# Altium schematic sheet [25] - LCD,TSC.SchDoc
size A2; DocumentNumber: 25; SheetNumber: 25; SheetTotal: 32
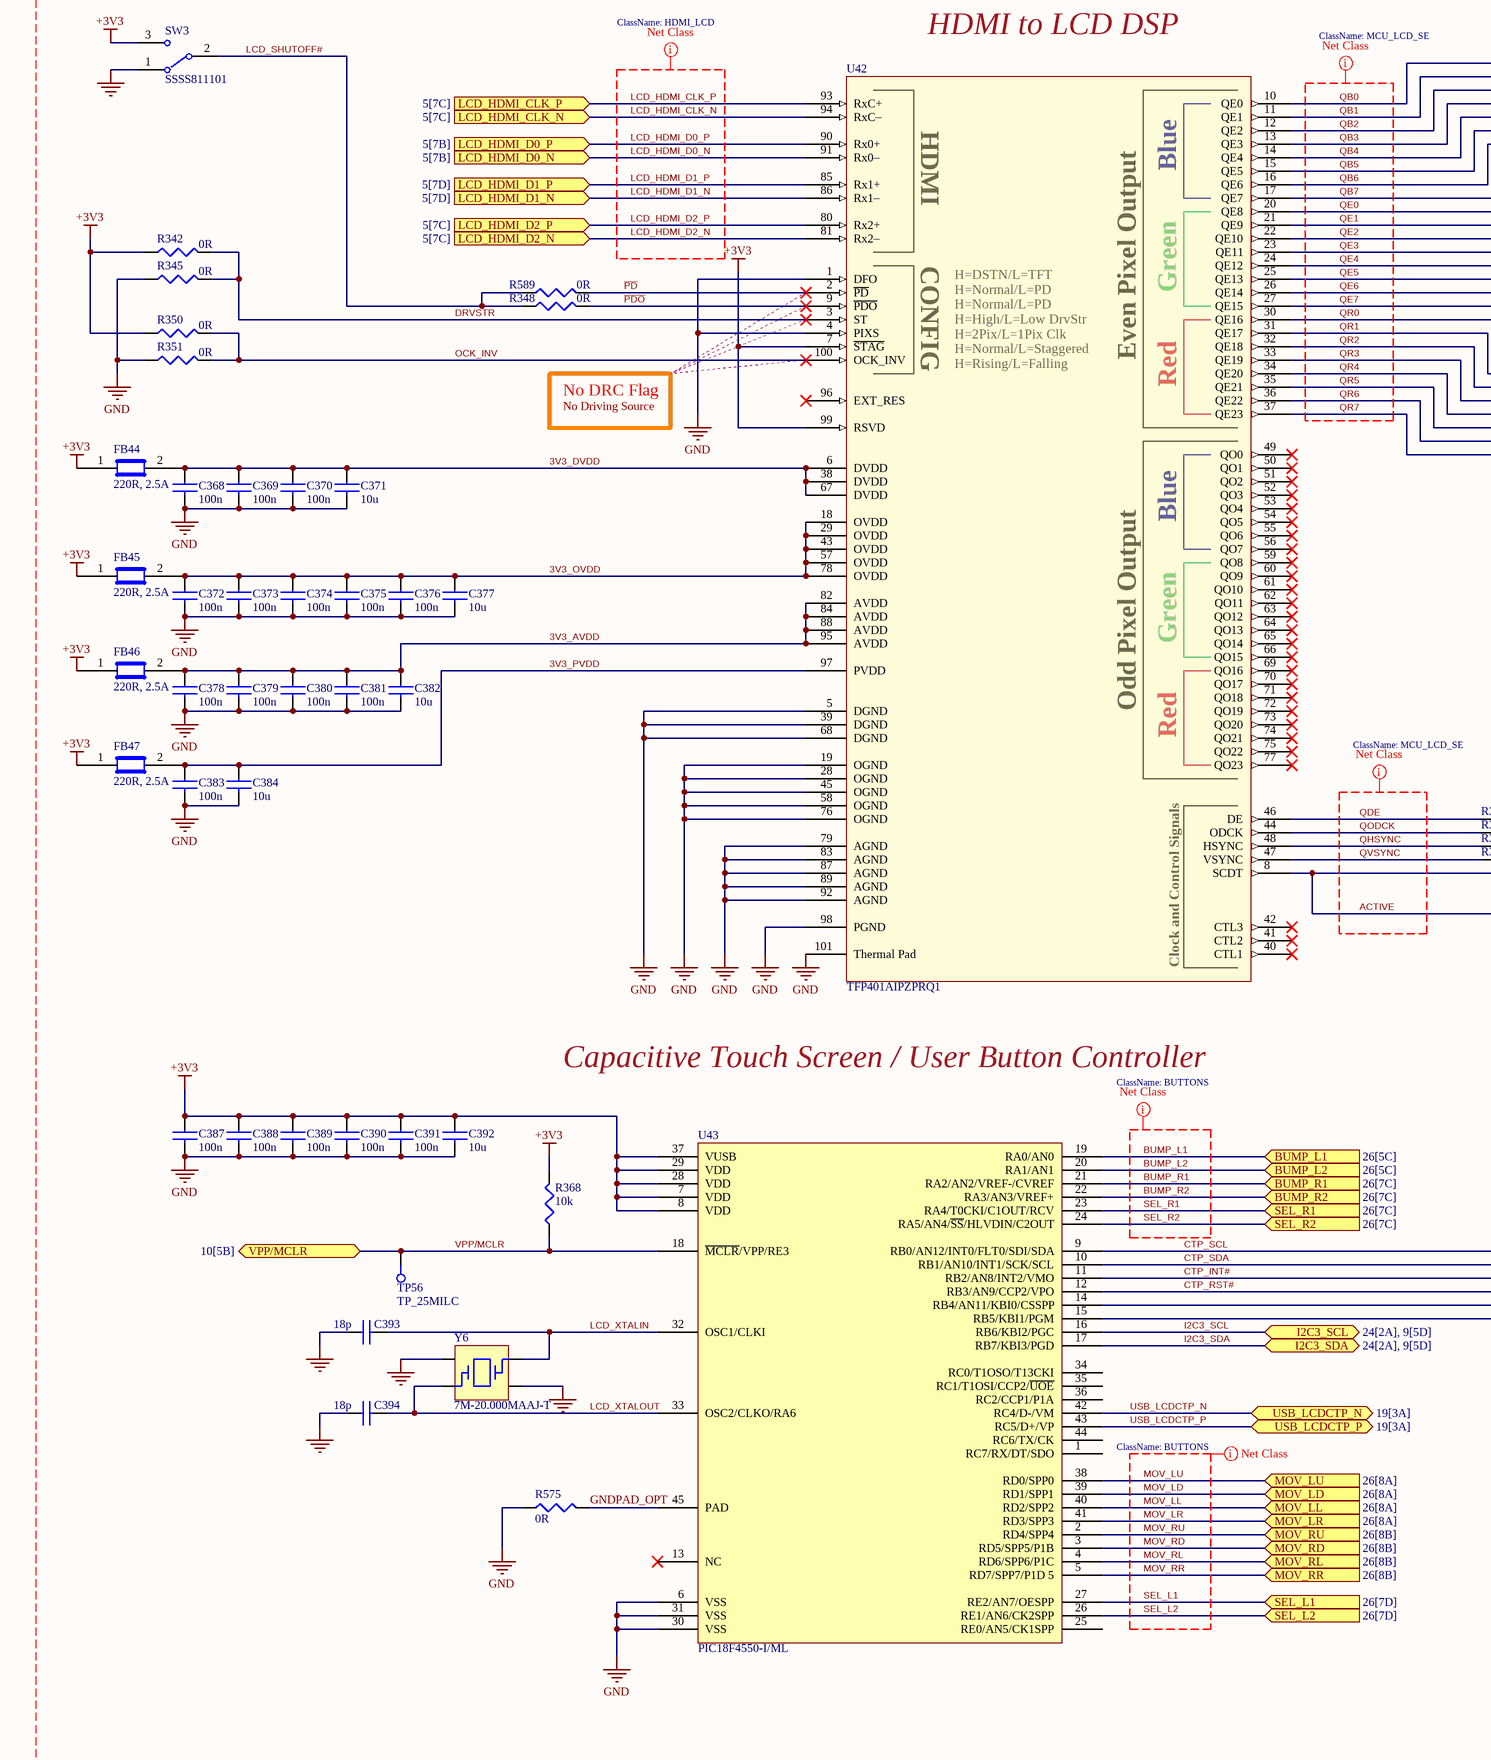
[diagram p0: [25] - LCD,TSC.SchDoc, bottom left]
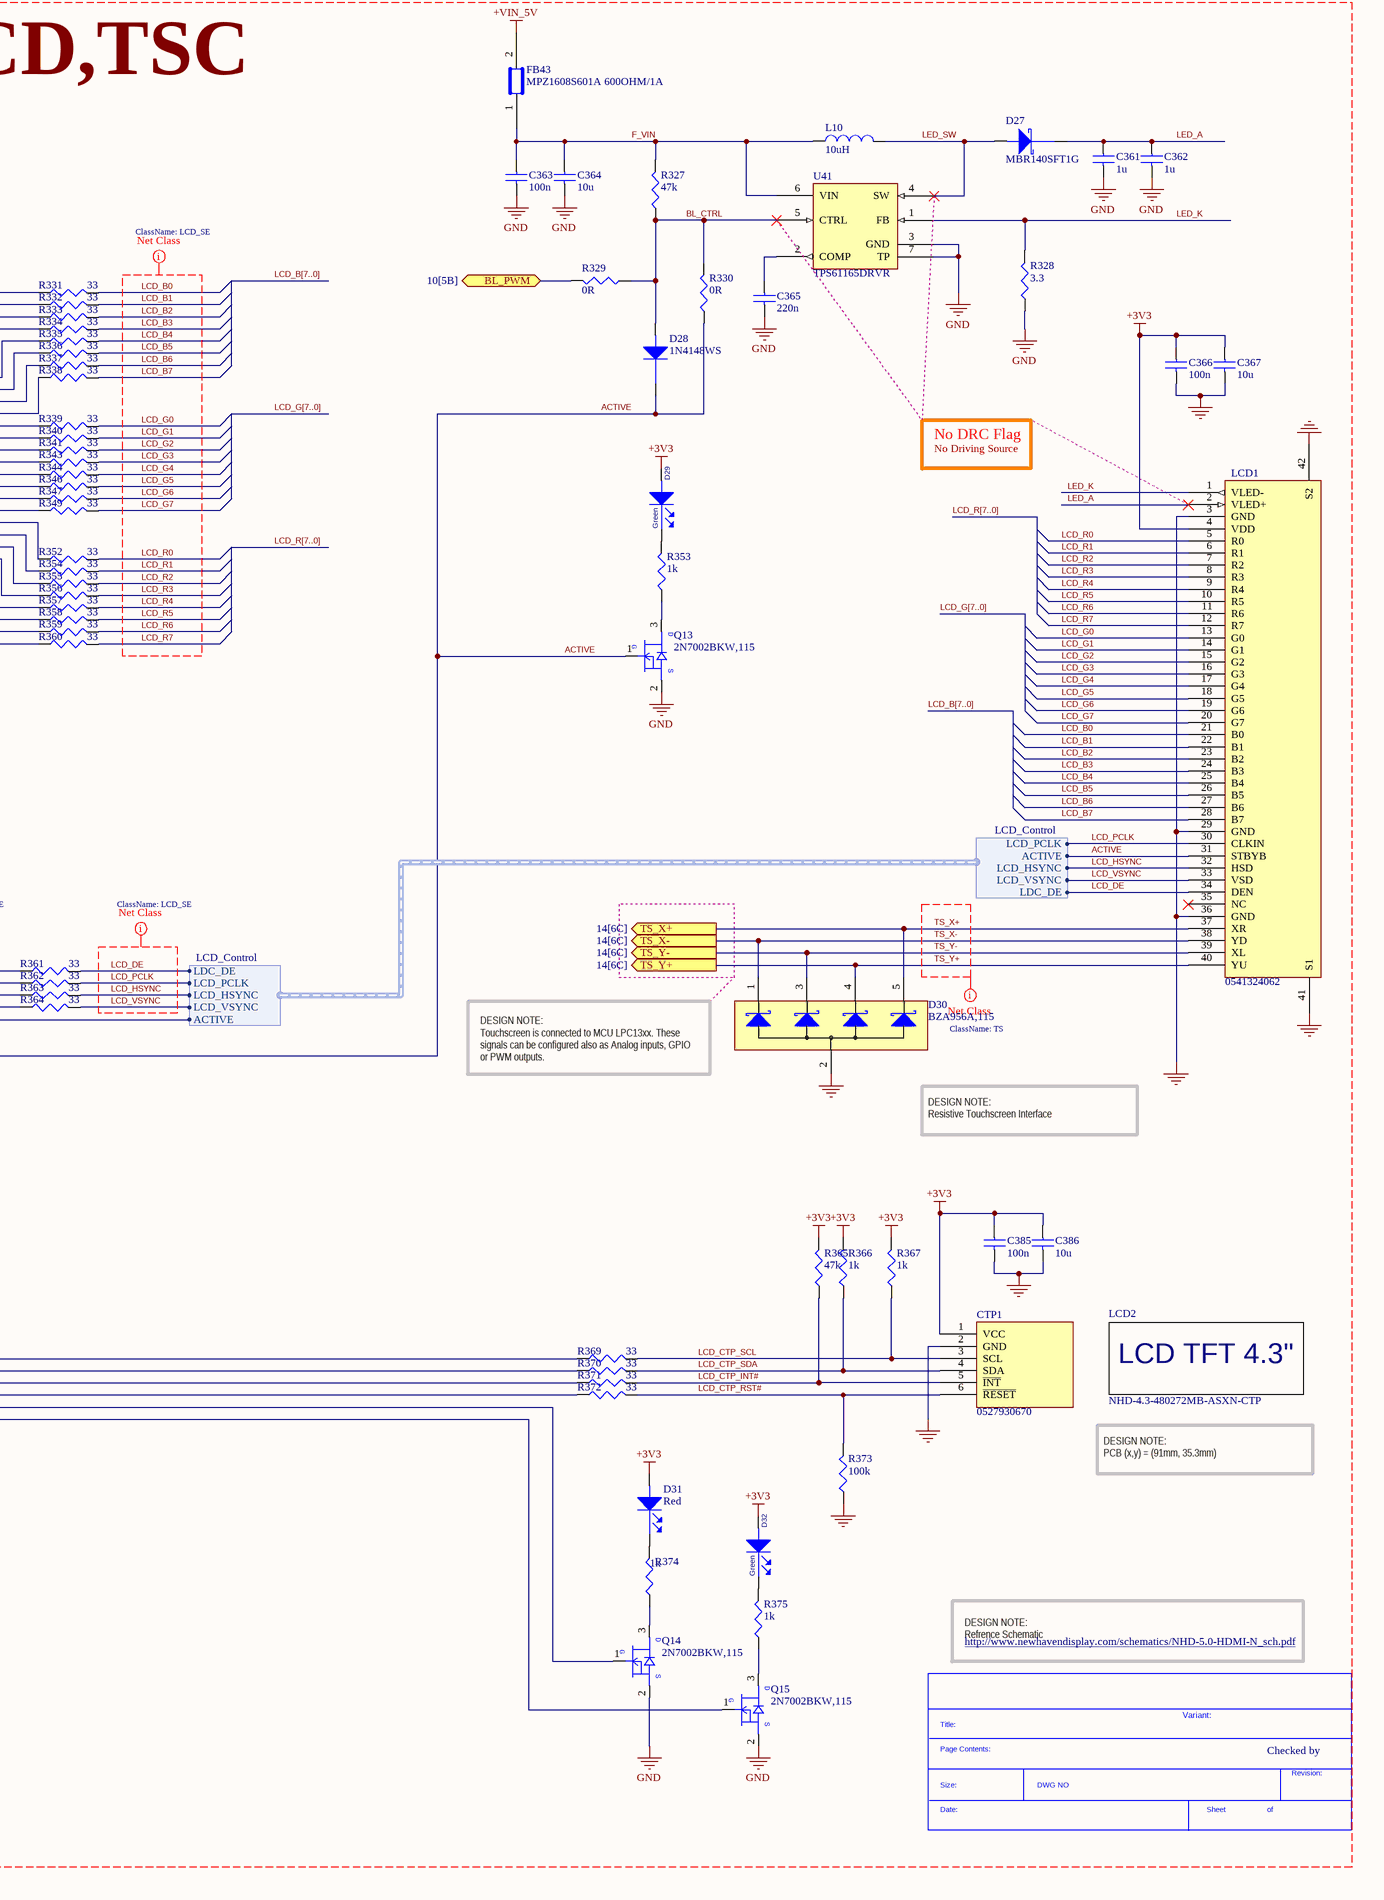
[diagram p1: [25] - LCD,TSC.SchDoc, bottom right]

## Parts
*  SDTitleBlock  (value not drawn)  (graphical)
C361  1u  [C0402]
C362  1u  [C0402]
C363  100n  [C0402]
C364  10u  [C0603]
C365  220n  [C0201]
C366  100n  [C0402]
C367  10u  [C0603]
C368  100n  [C0402]
C369  100n  [C0402]
C370  100n  [C0402]
C371  10u  [C0603]
C372  100n  [C0402]
C373  100n  [C0402]
C374  100n  [C0402]
C375  100n  [C0402]
C376  100n  [C0402]
C377  10u  [C0603]
C378  100n  [C0402]
C379  100n  [C0402]
C380  100n  [C0402]
C381  100n  [C0402]
C382  10u  [C0603]
C383  100n  [C0402]
C384  10u  [C0603]
C385  100n  [C0402]
C386  10u  [C0603]
C387  100n  [C0402]
C388  100n  [C0402]
C389  100n  [C0402]
C390  100n  [C0402]
C391  100n  [C0402]
C392  10u  [C0603]
C393  18p  [C0402]
C394  18p  [C0402]
CTP1  0527930670  [522710479]
D27  MBR140SFT1G  [SOD-123FL]
D28  1N4148WS  [SOD323]
D29  Green  [LED_0603]
D30  BZA956A,115  [SOT665]
D31  Red  [LED_0603]
D32  Green  [LED_0603]
FB43  MPZ1608S601A 600OHM/1A  [C0603]
FB44  220R, 2.5A  [C0603]
FB45  220R, 2.5A  [C0603]
FB46  220R, 2.5A  [C0603]
FB47  220R, 2.5A  [C0603]
L10  10uH  [IHLP_255MILX255MIL]
LCD1  0541324062  [0541324062]
LCD2  NHD-4.3-480272MB-ASXN-CTP  [NHD-4.3-480272MB-ASXN-CTP]
Q13  2N7002BKW,115  [SC70_SOT323]
Q14  2N7002BKW,115  [SC70_SOT323]
Q15  2N7002BKW,115  [SC70_SOT323]
R327  47k  [R0402]
R328  3.3  [R0402]
R329  0R  [R0402]
R330  0R  [R0402]
R331  33  [R0201]
R332  33  [R0201]
R333  33  [R0201]
R334  33  [R0201]
R335  33  [R0201]
R336  33  [R0201]
R337  33  [R0201]
R338  33  [R0201]
R339  33  [R0201]
R340  33  [R0201]
R341  33  [R0201]
R342  0R  [R0402]
R343  33  [R0201]
R344  33  [R0201]
R345  0R  [R0402]
R346  33  [R0201]
R347  33  [R0201]
R348  0R  [R0402]
R349  33  [R0201]
R350  0R  [R0402]
R351  0R  [R0402]
R352  33  [R0201]
R353  1k  [R0201]
R354  33  [R0201]
R355  33  [R0201]
R356  33  [R0201]
R357  33  [R0201]
R358  33  [R0201]
R359  33  [R0201]
R360  33  [R0201]
R361  33  [R0201]
R362  33  [R0201]
R363  33  [R0201]
R364  33  [R0201]
R365  47k  [R0201]
R366  1k  [R0201]
R367  1k  [R0201]
R368  10k  [R0201]
R369  33  [R0201]
R370  33  [R0201]
R371  33  [R0201]
R372  33  [R0201]
R373  100k  [R0201]
R374  1k  [R0201]
R375  1k  [R0201]
R575  0R  [R0805_small]
R589  0R  [R0402]
SW3  SSSS811101  [SSSS811101]
TP56  TP_25MILC  [TP_25C]  (no BOM)
U41  TPS61165DRVR  [SON65P200X80_HS-7N]
U42  TFP401AIPZPRQ1  [TSQFP50P1600X1600X120_HS-101N]
U43  PIC18F4550-I/ML  [QFN44_8MMX8MM]
Y6  7M-20.000MAAJ-T  [7M]

## Ports
BL_PWM (bidir, see 10[5B]), BUMP_L1 (in, see 26[5C]), BUMP_L2 (in, see 26[5C]), BUMP_R1 (in, see 26[7C]), BUMP_R2 (in, see 26[7C]), I2C3_SCL (bidir, see 24[2A], 9[5D]), I2C3_SDA (bidir, see 24[2A], 9[5D]), LCD_HDMI_CLK_N (in, see 5[7C]), LCD_HDMI_CLK_P (in, see 5[7C]), LCD_HDMI_D0_N (in, see 5[7B]), LCD_HDMI_D0_P (in, see 5[7B]), LCD_HDMI_D1_N (in, see 5[7D]), LCD_HDMI_D1_P (in, see 5[7D]), LCD_HDMI_D2_N (in, see 5[7C]), LCD_HDMI_D2_P (in, see 5[7C]), MOV_LD (in, see 26[8A]), MOV_LL (in, see 26[8A]), MOV_LR (in, see 26[8A]), MOV_LU (in, see 26[8A]), MOV_RD (in, see 26[8B]), MOV_RL (in, see 26[8B]), MOV_RR (in, see 26[8B]), MOV_RU (in, see 26[8B]), SEL_L1 (in, see 26[7D]), SEL_L2 (in, see 26[7D]), SEL_R1 (in, see 26[7C]), SEL_R2 (in, see 26[7C]), TS_X+ (out, see 14[6C]), TS_X- (out, see 14[6C]), TS_Y+ (out, see 14[6C]), TS_Y- (out, see 14[6C]), USB_LCDCTP_N (bidir, see 19[3A]), USB_LCDCTP_P (bidir, see 19[3A]), VPP/MCLR (bidir, see 10[5B])

## Harnesses
LCD_Control: LDC_DE, LCD_PCLK, LCD_HSYNC, LCD_VSYNC, ACTIVE
LCD_Control: LCD_HSYNC, LCD_PCLK, LCD_VSYNC, LDC_DE, ACTIVE

## Nets
+3V3: C366.1 C367.1 C385.1 C386.1 C387.1 C388.1 C389.1 C390.1 C391.1 C392.1 CTP1.1(VCC) D29.2(ANODE) D31.2(ANODE) D32.2(ANODE) FB44.1 FB45.1 FB46.1 FB47.1 LCD1.4(VDD) R342.1 R350.1 R365.2 R366.2 R367.2 R368.2 SW3.3 U42.7(~{STAG}) U42.99(RSVD) U43.7(VDD) U43.8(VDD) U43.28(VDD) U43.29(VDD) U43.37(VUSB)
+VIN_5V: FB43.2
GND: C361.2 C362.2 C363.2 C364.2 C365.2 C366.2 C367.2 C368.2 C369.2 C370.2 C371.2 C372.2 C373.2 C374.2 C375.2 C376.2 C377.2 C378.2 C379.2 C380.2 C381.2 C382.2 C383.2 C384.2 C385.2 C386.2 C387.2 C388.2 C389.2 C390.2 C391.2 C392.2 C393.1 C394.1 CTP1.2(GND) D30.2 LCD1.3(GND) LCD1.29(GND) LCD1.36(GND) LCD1.41(S1) LCD1.42(S2) Q13.2(SOURCE) Q14.2(SOURCE) Q15.2(SOURCE) R328.1 R345.1 R351.1 R373.1 R575.1 SW3.1 U41.3(GND) U41.7(TP) U42.1(DFO) U42.4(PIXS) U42.5(DGND) U42.19(OGND) U42.28(OGND) U42.39(DGND) U42.45(OGND) U42.58(OGND) U42.68(DGND) U42.76(OGND) U42.79(AGND) U42.83(AGND) U42.87(AGND) U42.89(AGND) U42.92(AGND) U42.98(PGND) U42.101(Thermal_Pad) U43.6(VSS) U43.30(VSS) U43.31(VSS) Y6.2 Y6.4
3V3_AVDD: C378.1 C379.1 C380.1 C381.1 C382.1 FB46.2 U42.82(AVDD) U42.84(AVDD) U42.88(AVDD) U42.95(AVDD)
3V3_DVDD: C368.1 C369.1 C370.1 C371.1 FB44.2 U42.6(DVDD) U42.38(DVDD) U42.67(DVDD)
3V3_OVDD: C372.1 C373.1 C374.1 C375.1 C376.1 C377.1 FB45.2 U42.18(OVDD) U42.29(OVDD) U42.43(OVDD) U42.57(OVDD) U42.78(OVDD)
3V3_PVDD: C383.1 C384.1 FB47.2 U42.97(PVDD)
ACTIVE: D28.1(Cathode) LCD1.31(STBYB) Q13.1(GATE) R330.1 U42.8(SCDT) ; harness LCD_Control.ACTIVE
BL_CTRL: D28.2(Anode) R327.1 R329.1 R330.2 U41.5(CTRL)
BL_PWM: R329.2 ; port BL_PWM
BUMP_L1: U43.19(RA0/AN0) ; port BUMP_L1
BUMP_L2: U43.20(RA1/AN1) ; port BUMP_L2
BUMP_R1: U43.21(RA2/AN2/VREF-/CVREF) ; port BUMP_R1
BUMP_R2: U43.22(RA3/AN3/VREF+) ; port BUMP_R2
CTP_INT#: R371.1 U43.11(RB2/AN8/INT2/VMO)
CTP_RST#: R372.1 U43.12(RB3/AN9/CCP2/VPO)
CTP_SCL: R369.1 U43.9(RB0/AN12/INT0/FLT0/SDI/SDA)
CTP_SDA: R370.1 U43.10(RB1/AN10/INT1/SCK/SCL)
DRVSTR: R342.2 R345.2 U42.3(ST)
F_VIN: C363.1 C364.1 FB43.1 L10.1 R327.2 U41.6(VIN)
GNDPAD_OPT: R575.2 U43.45(PAD)
I2C3_SCL: U43.16(RB6/KBI2/PGC) ; port I2C3_SCL
I2C3_SDA: U43.17(RB7/KBI3/PGD) ; port I2C3_SDA
LCD_B0: LCD1.21(B0) R331.2
LCD_B1: LCD1.22(B1) R332.2
LCD_B2: LCD1.23(B2) R333.2
LCD_B3: LCD1.24(B3) R334.2
LCD_B4: LCD1.25(B4) R335.2
LCD_B5: LCD1.26(B5) R336.2
LCD_B6: LCD1.27(B6) R337.2
LCD_B7: LCD1.28(B7) R338.2
LCD_CTP_INT#: CTP1.5(~{INT}) R365.1 R371.2
LCD_CTP_RST#: CTP1.6(~{RESET}) R372.2 R373.2
LCD_CTP_SCL: CTP1.3(SCL) R367.1 R369.2
LCD_CTP_SDA: CTP1.4(SDA) R366.1 R370.2
LCD_DE: LCD1.34(DEN) R361.2 ; harness LCD_Control.LDC_DE
LCD_G0: LCD1.13(G0) R339.2
LCD_G1: LCD1.14(G1) R340.2
LCD_G2: LCD1.15(G2) R341.2
LCD_G3: LCD1.16(G3) R343.2
LCD_G4: LCD1.17(G4) R344.2
LCD_G5: LCD1.18(G5) R346.2
LCD_G6: LCD1.19(G6) R347.2
LCD_G7: LCD1.20(G7) R349.2
LCD_HDMI_CLK_N: U42.94(RxC–) ; port LCD_HDMI_CLK_N
LCD_HDMI_CLK_P: U42.93(RxC+) ; port LCD_HDMI_CLK_P
LCD_HDMI_D0_N: U42.91(Rx0–) ; port LCD_HDMI_D0_N
LCD_HDMI_D0_P: U42.90(Rx0+) ; port LCD_HDMI_D0_P
LCD_HDMI_D1_N: U42.86(Rx1–) ; port LCD_HDMI_D1_N
LCD_HDMI_D1_P: U42.85(Rx1+) ; port LCD_HDMI_D1_P
LCD_HDMI_D2_N: U42.81(Rx2–) ; port LCD_HDMI_D2_N
LCD_HDMI_D2_P: U42.80(Rx2+) ; port LCD_HDMI_D2_P
LCD_HSYNC: LCD1.32(HSD) R363.2 ; harness LCD_Control.LCD_HSYNC
LCD_PCLK: LCD1.30(CLKIN) R362.2 ; harness LCD_Control.LCD_PCLK
LCD_R0: LCD1.5(R0) R352.2
LCD_R1: LCD1.6(R1) R354.2
LCD_R2: LCD1.7(R2) R355.2
LCD_R3: LCD1.8(R3) R356.2
LCD_R4: LCD1.9(R4) R357.2
LCD_R5: LCD1.10(R5) R358.2
LCD_R6: LCD1.11(R6) R359.2
LCD_R7: LCD1.12(R7) R360.2
LCD_SHUTOFF#: R348.1 R589.1 SW3.2
LCD_VSYNC: LCD1.33(VSD) R364.2 ; harness LCD_Control.LCD_VSYNC
LCD_XTALIN: C393.2 U43.32(OSC1/CLKI) Y6.3
LCD_XTALOUT: C394.2 U43.33(OSC2/CLKO/RA6) Y6.1
LED_A: C361.1 C362.1 D27.1(Cathode) LCD1.2(VLED+)
LED_K: LCD1.1(VLED-) R328.2 U41.1(FB)
LED_SW: D27.2(Anode) L10.2 U41.4(SW)
MOV_LD: U43.39(RD1/SPP1) ; port MOV_LD
MOV_LL: U43.40(RD2/SPP2) ; port MOV_LL
MOV_LR: U43.41(RD3/SPP3) ; port MOV_LR
MOV_LU: U43.38(RD0/SPP0) ; port MOV_LU
MOV_RD: U43.3(RD5/SPP5/P1B) ; port MOV_RD
MOV_RL: U43.4(RD6/SPP6/P1C) ; port MOV_RL
MOV_RR: U43.5(RD7/SPP7/P1D_5) ; port MOV_RR
MOV_RU: U43.2(RD4/SPP4) ; port MOV_RU
OCK_INV: R350.2 R351.2 U42.100(OCK_INV)
~{PD}: R589.2 U42.2(~{PD})
~{PDO}: R348.2 U42.9(~{PDO})
QB0: R331.1 U42.10(QE0)
QB1: R332.1 U42.11(QE1)
QB2: R333.1 U42.12(QE2)
QB3: R334.1 U42.13(QE3)
QB4: R335.1 U42.14(QE4)
QB5: R336.1 U42.15(QE5)
QB6: R337.1 U42.16(QE6)
QB7: R338.1 U42.17(QE7)
QDE: R361.1 U42.46(DE)
QE0: R339.1 U42.20(QE8)
QE1: R340.1 U42.21(QE9)
QE2: R341.1 U42.22(QE10)
QE3: R343.1 U42.23(QE11)
QE4: R344.1 U42.24(QE12)
QE5: R346.1 U42.25(QE13)
QE6: R347.1 U42.26(QE14)
QE7: R349.1 U42.27(QE15)
QHSYNC: R363.1 U42.48(HSYNC)
QODCK: R362.1 U42.44(ODCK)
QR0: R352.1 U42.30(QE16)
QR1: R354.1 U42.31(QE17)
QR2: R355.1 U42.32(QE18)
QR3: R356.1 U42.33(QE19)
QR4: R357.1 U42.34(QE20)
QR5: R358.1 U42.35(QE21)
QR6: R359.1 U42.36(QE22)
QR7: R360.1 U42.37(QE23)
QVSYNC: R364.1 U42.47(VSYNC)
SEL_L1: U43.27(RE2/AN7/OESPP) ; port SEL_L1
SEL_L2: U43.26(RE1/AN6/CK2SPP) ; port SEL_L2
SEL_R1: U43.23(RA4/T0CKI/C1OUT/RCV) ; port SEL_R1
SEL_R2: U43.24(RA5/AN4/~{SS}/HLVDIN/C2OUT) ; port SEL_R2
TS_X+: D30.5 LCD1.37(XR) ; port TS_X+
TS_X-: D30.1 LCD1.38(YD) ; port TS_X-
TS_Y+: D30.4 LCD1.40(YU) ; port TS_Y+
TS_Y-: D30.3 LCD1.39(XL) ; port TS_Y-
USB_LCDCTP_N: U43.42(RC4/D-/VM) ; port USB_LCDCTP_N
USB_LCDCTP_P: U43.43(RC5/D+/VP) ; port USB_LCDCTP_P
VPP/MCLR: R368.1 TP56.1 U43.18(~{MCLR}/VPP/RE3) ; port VPP/MCLR
NetC365_1: C365.1 U41.2(COMP)
NetD29_1: D29.1(cathode) R353.2
NetD31_1: D31.1(cathode) R374.2
NetD32_1: D32.1(cathode) R375.2
NetQ13_3: Q13.3(DRAIN) R353.1
NetQ14_1: Q14.1(GATE) U43.14(RB4/AN11/KBI0/CSSPP)
NetQ14_3: Q14.3(DRAIN) R374.1
NetQ15_1: Q15.1(GATE) U43.15(RB5/KBI1/PGM)
NetQ15_3: Q15.3(DRAIN) R375.1

Not connected (* = marked no-connect by the designer): LCD1 35(NC)*; U42 40(CTL1)* 41(CTL2)* 42(CTL3)* 49(QO0)* 50(QO1)* 51(QO2)* 52(QO3)* 53(QO4)* 54(QO5)* 55(QO6)* 56(QO7)* 59(QO8)* 60(QO9)* 61(QO10)* 62(QO11)* 63(QO12)* 64(QO13)* 65(QO14)* 66(QO15)* 69(QO16)* 70(QO17)* 71(QO18)* 72(QO19)* 73(QO20)* 74(QO21)* 75(QO22)* 77(QO23)* 96(EXT_RES)*; U43 1(RC7/RX/DT/SDO) 13(NC)* 25(RE0/AN5/CK1SPP) 34(RC0/T1OSO/T13CKI) 35(RC1/T1OSI/CCP2/~{UOE}) 36(RC2/CCP1/P1A) 44(RC6/TX/CK)

## Buses and harness runs
bus LCD_B[7..0]
bus LCD_G[7..0]
bus LCD_R[7..0]

## Layout directives
net class TS: TS_X+, TS_X-, TS_Y+, TS_Y-
net class LCD_SE: LCD_B0, LCD_B1, LCD_B2, LCD_B3, LCD_B4, LCD_B5, LCD_B6, LCD_B7, LCD_DE, LCD_G0, LCD_G1, LCD_G2, LCD_G3, LCD_G4, LCD_G5, LCD_G6, LCD_G7, LCD_HSYNC, LCD_PCLK, LCD_R0, LCD_R1, LCD_R2, LCD_R3, LCD_R4, LCD_R5, LCD_R6, LCD_R7, LCD_VSYNC
net class MCU_LCD_SE: ACTIVE, QB0, QB1, QB2, QB3, QB4, QB5, QB6, QB7, QDE, QE0, QE1, QE2, QE3, QE4, QE5, QE6, QE7, QHSYNC, QODCK, QR0, QR1, QR2, QR3, QR4, QR5, QR6, QR7, QVSYNC
net class BUTTONS: BUMP_L1, BUMP_L2, BUMP_R1, BUMP_R2, MOV_LD, MOV_LL, MOV_LR, MOV_LU, MOV_RD, MOV_RL, MOV_RR, MOV_RU, SEL_L1, SEL_L2, SEL_R1, SEL_R2
net class [25] - LCD/TSC: 3V3_AVDD, 3V3_DVDD, 3V3_OVDD, 3V3_PVDD, +3V3, +VIN_5V, ACTIVE, BL_CTRL, BUMP_L1, BUMP_L2, BUMP_R1, BUMP_R2, CTP_INT#, CTP_RST#, CTP_SCL, CTP_SDA, DRVSTR, F_VIN, GND, GNDPAD_OPT, I2C3_SCL, I2C3_SDA, LCD_B0, LCD_B1, LCD_B2, LCD_B3, LCD_B4, LCD_B5, LCD_B6, LCD_B7, LCD_B[7..0], LCD_CTP_INT#, LCD_CTP_RST#, LCD_CTP_SCL, LCD_CTP_SDA, LCD_DE, LCD_G0, LCD_G1, LCD_G2, LCD_G3, LCD_G4, LCD_G5, LCD_G6, LCD_G7, LCD_G[7..0], LCD_HDMI_CLK_N, LCD_HDMI_CLK_P, LCD_HDMI_D0_N, LCD_HDMI_D0_P, LCD_HDMI_D1_N, LCD_HDMI_D1_P, LCD_HDMI_D2_N, LCD_HDMI_D2_P, LCD_HSYNC, LCD_PCLK, LCD_R0, LCD_R1, LCD_R2, LCD_R3, LCD_R4, LCD_R5, LCD_R6, LCD_R7, LCD_R[7..0], LCD_SHUTOFF#, LCD_VSYNC, LCD_XTALIN, LCD_XTALOUT, LED_A, LED_K, LED_SW, MOV_LD, MOV_LL, MOV_LR, MOV_LU, MOV_RD, MOV_RL, MOV_RR, MOV_RU, OCK_INV, QB0, QB1, QB2, QB3, QB4, QB5, QB6, QB7, QDE, QE0, QE1, QE2, QE3, QE4, QE5, QE6, QE7, QHSYNC, QODCK, QR0, QR1, QR2, QR3, QR4, QR5, QR6, QR7, QVSYNC, SEL_L1, SEL_L2, SEL_R1, SEL_R2, TS_X+, TS_X-, TS_Y+, TS_Y-, USB_LCDCTP_N, USB_LCDCTP_P, VPP/MCLR, ~{PDO}, ~{PD}
net class HDMI_LCD: LCD_HDMI_CLK_N, LCD_HDMI_CLK_P, LCD_HDMI_D0_N, LCD_HDMI_D0_P, LCD_HDMI_D1_N, LCD_HDMI_D1_P, LCD_HDMI_D2_N, LCD_HDMI_D2_P

## Notes on the sheet
- LCD,TSC
- HDMI to LCD DSP
- No DRC Flag
- No Driving Source
- DESIGN NOTE:
  Touchscreen is connected to MCU LPC13xx. These signals can be configured also as Analog inputs, GPIO or PWM outputs.
- DESIGN NOTE:
  Resistive Touchscreen Interface
- Capacitive Touch Screen / User Button Controller
- DESIGN NOTE:
  PCB (x,y) = (91mm, 35.3mm)
- http://www.newhavendisplay.com/schematics/NHD-5.0-HDMI-N_sch.pdf
- DESIGN NOTE:
  Refrence Schematic
- Variant:
- Checked by
- (in symbol 2N7002BKW,115) D; G; S
- (in symbol NHD-4.3-480272MB-ASXN-CTP) LCD TFT 4.3"
- (in symbol SDTitleBlock) Title:; Page Contents:; Revision:; Size:; DWG NO; Date:; Sheet; of
- (in symbol TFP401AIPZPRQ1) HDMI; Blue; CONFIG; Green; Even Pixel Output; H=DSTN/L=TFT / H=Normal/L=PD / H=Normal/L=PD / H=High/L=Low DrvStr / H=2Pix/L=1Pix Clk / H=Normal/L=Staggered / H=Rising/L=Falling; Red; Odd Pixel Output; Clock and Control Signals

## Library data of the parts
C361 C362 = C1005X5R1C105K: CAP CER 1.0UF 16V X5R 0402; Manufacturer: TDK Corporation; Capacitance: 1.0µF; Value: 1uF; .Checked PCB: used; Tolerance: ±10%; Category: Capacitors; Supplier Part Number: 445-4978-1-ND; Manufacturer Part Number: C1005X5R1C105K; Operating Temperature: -55°C ~ 85°C; Package / Case: 0402 (1005 Metric); Price 1k [$]: 0.02080; .Checked SCH: used; Voltage - Rated: 16V; Supplier: Digikey; Supplier 1: Digi-Key; Supplier Part Number 1: 445-4978-1-ND; RoHS: RoHS Compliant; Stock 1: 341010; Pricing 1: 1=0.24, 10=0.16, 100=0.064, 250=0.046, 500=0.0328, 1000=0.024 (USD); Temperature Coefficient: X5R; Mounting Type: Surface Mount, MLCC; Applications: General Purpose; Ratings: -; Size / Dimension: 0.039" L x 0.020" W (1.00mm x 0.50mm); Height - Seated (Max): -; Thickness (Max): 0.022" (0.55mm); Lead Spacing: -; Features: -; Packaging: Cut Tape (CT); Lead Style: -; ComponentLink1URL: http://www.tdk.co.jp/tefe02/e412_c.pdf; ComponentLink1Description: http://www.tdk.co.jp/tefe02/e412_c.pdf; Supplier 2: Digi-Key; Supplier Part Number 2: 445-13181-1-ND
C363 C366 C368-C370 C372-C376 C378-C381 C383 C385 C387-C391 = C1005X5R1H104K: CAP CER .10UF 50V X5R 10% 0402; Manufacturer: TDK Corporation; Capacitance: 0.1µF; Value: 100nF; .Checked PCB: used; Category: Capacitors; Supplier Part Number: 445-5942-1-ND; Manufacturer Part Number: C1005X5R1H104K; Operating Temperature: -55°C ~ 85°C; Package / Case: 0402 (1005 Metric); Price 1k [$]: 0.02340; .Checked SCH: used; Voltage - Rated: 50V; Supplier: Digikey; Supplier 1: Digi-Key; Supplier Part Number 1: 445-5942-1-ND; RoHS: RoHS Compliant; Stock 1: 106926; Pricing 1: 1=0.27, 10=0.18, 100=0.072, 250=0.05176, 500=0.0369, 1000=0.027 (USD); Tolerance: ±10%; Temperature Coefficient: X5R; Mounting Type: Surface Mount, MLCC; Applications: General Purpose; Ratings: -; Size / Dimension: 0.039" L x 0.020" W (1.00mm x 0.50mm); Height - Seated (Max): -; Thickness (Max): 0.022" (0.55mm); Lead Spacing: -; Features: -; Packaging: Cut Tape (CT); Lead Style: -; ComponentLink1URL: http://www.tdk.co.jp/tefe02/e412_c.pdf; ComponentLink1Description: http://www.tdk.co.jp/tefe02/e412_c.pdf; Supplier 2: Digi-Key; Supplier Part Number 2: 311-1697-6-ND
C364 C367 C371 C377 C382 C384 C386 C392 = C1608X5R0J106M: CAP CER 10UF 6.3V X5R 20% 0603; Manufacturer: TDK Corporation; Capacitance: 10µF; Value: 10µF; .Checked PCB: used; Category: Capacitors; Supplier Part Number: 445-4112-1-ND; Manufacturer Part Number: C1608X5R0J106M; Operating Temperature: -55°C ~ 85°C; Package / Case: 0603 (1608 Metric); Price 1k [$]: 0.08580; .Checked SCH: used; Voltage - Rated: 6.3V; Features: Low ESR; Supplier: Digikey; Supplier 1: Digi-Key; Supplier Part Number 1: 445-4112-1-ND; RoHS: RoHS Compliant; Stock 1: 48157; Pricing 1: 1=0.46, 10=0.363, 100=0.1898, 250=0.14024, 500=0.1089, 1000=0.0858 (USD); Tolerance: ±20%; Temperature Coefficient: X5R; Mounting Type: Surface Mount, MLCC; Applications: General Purpose; Ratings: -; Size / Dimension: 0.063" L x 0.031" W (1.60mm x 0.80mm); Height - Seated (Max): -; Thickness (Max): 0.037" (0.95mm); Lead Spacing: -; Packaging: Cut Tape (CT); Lead Style: -; ComponentLink1URL: http://www.tdk.com/pdf/general_B11.pdf; ComponentLink1Description: http://www.tdk.com/pdf/general_B11.pdf
C365 = C0603X5R0J224M030BB: CAP CER 0.22UF 6.3V 20% X5R 0201; Manufacturer: TDK Corporation; Capacitance: 0.22µF; .Checked PCB: used; .Creator: MM; Supplier 1: Digi-Key; Manufacturer Part Number: C0603X5R0J224M030BB; RoHS: RoHS Compliant; Category: Capacitors; Stock 1: 205900; Pricing 1: 1=0.15, 10=0.102, 100=0.0485, 250=0.0408, 500=0.03418, 1000=0.0275, 5000=0.02325 (USD); Packaging: Cut Tape (CT); Tolerance: ±20%; Voltage - Rated: 6.3V; Temperature Coefficient: X5R; Mounting Type: Surface Mount, MLCC; Operating Temperature: -55°C ~ 85°C; Applications: General Purpose; Ratings: -; Package / Case: 0201 (0603 Metric); Size / Dimension: 0.024" L x 0.012" W (0.60mm x 0.30mm); Height - Seated (Max): -; Thickness (Max): 0.013" (0.33mm); Lead Spacing: -; Features: -; Lead Style: -; ComponentLink1URL: http://product.tdk.com/en/catalog/datasheets/mlcc_commercial_general_en.pdf; ComponentLink1Description: http://product.tdk.com/en/catalog/datasheets/mlcc_commercial_general_en.pdf; Supplier Part Number 1: 445-5929-1-ND; .Checked SCH: used; Supplier 2: Digi-Key; Supplier Part Number 2: 1276-1042-6-ND
C393 C394 = C1005C0G1H180J: CAP CER 18PF 50V C0G 5% 0402; Manufacturer: TDK Corporation; .Checked PCB: used; Temperature Coefficient: C0G, NP0; Capacitance: 18pF; Category: Capacitors; Supplier Part Number: 445-1238-1-ND; Manufacturer Part Number: C1005C0G1H180J; Operating Temperature: -55°C ~ 125°C; Package / Case: 0402 (1005 Metric); Price 1k [$]: 0.00468; Value: 18pF; .Checked SCH: used; Voltage - Rated: 50V; Supplier: Digikey; Supplier 1: Digi-Key; Supplier Part Number 1: 445-1238-1-ND; RoHS: RoHS Compliant; Stock 1: 24321; Pricing 1: 1=0.08, 10=0.05, 100=0.018, 250=0.013, 500=0.0096, 1000=0.0065 (USD); Tolerance: ±5%; Mounting Type: Surface Mount, MLCC; Applications: General Purpose; Ratings: -; Size / Dimension: 0.039" L x 0.020" W (1.00mm x 0.50mm); Height - Seated (Max): -; Thickness (Max): 0.022" (0.55mm); Lead Spacing: -; Features: -; Packaging: Cut Tape (CT); Lead Style: -; ComponentLink1URL: http://www.tdk.co.jp/tefe02/e412_c.pdf; ComponentLink1Description: http://www.tdk.co.jp/tefe02/e412_c.pdf
CTP1 = 0527930670: CONN FPC TOP 6POS 1.00MM R/A; Manufacturer: Molex; Current Rating: 500mA; Voltage Rating: 50V; Number of Positions: 6; Contact Resistance: 30mR; Wire/Cable Type: Straight; Pitch: 0.039inch; .Creator: MB; Supplier 1: Digi-Key; Manufacturer Part Number: 0527930670; Stock 1: 15950; Pricing 1: 1=0.46, 10=0.439, 25=0.3764, 50=0.3198, 100=0.3072, 250=0.27588, 500=0.26334 (USD); Mount: Surface Mount; Contact Material: Bronze; Contact Plating: Nickel,Tin; Housing Colour: Natural; Housing Material: Polyphenylene; Min Operating Temperature: -20°C; Max Operating Temperature: 85°C; Package Quantity: 1; Packaging: Tape and Reel; Number of Rows: 1; Termination: Solder; Orientation: Right Angle; Length: 12.3mm; Depth: 4.8mm; Radiation Hardening: No; Flammability Rating: UL94 V-0; ComponentLink1URL: https://datasheet.ciiva.com/671/527930670-sd-671124.pdf; ComponentLink1Description: https://datasheet.ciiva.com/671/527930670-sd-671124.pdf; ComponentLink2URL: https://datasheet.ciiva.com/671/527930670-sd-671126.pdf; ComponentLink2Description: https://datasheet.ciiva.com/671/527930670-sd-671126.pdf; ComponentLink3URL: https://datasheet.ciiva.com/3112/0527930670-ffc-fpc-connectors-3112203.pdf; ComponentLink3Description: https://datasheet.ciiva.com/3112/0527930670-ffc-fpc-connectors-3112203.pdf; ComponentLink4URL: https://datasheet.ciiva.com/3112/0527930670-ffc-fpc-connectors-3112204.pdf; ComponentLink4Description: https://datasheet.ciiva.com/3112/0527930670-ffc-fpc-connectors-3112204.pdf; Supplier Part Number 1: WM4880DKR-ND; .Checked SCH: *; .Checked PCB: *
D27 = MBR140SFT1G: DIODE SCHOTTKY 40V 1A SOD123L; Manufacturer: ON Semiconductor; Voltage - Forward (Vf) (Max) @ If: 550mV @ 1A; Speed: Fast Recovery =< 500ns, > 200mA (Io); Current - Reverse Leakage @ Vr: 500µA @ 40V; .Creator: MM; .Checked PCB: used; Supplier 1: Digi-Key; Manufacturer Part Number: MBR140SFT1G; RoHS: RoHS Compliant; Category: Discrete Semiconductor Products; Stock 1: 9727; Pricing 1: 1=0.47, 10=0.333, 25=0.274, 100=0.2188, 250=0.1594, 500=0.12944, 1000=0.0995 (USD); Packaging: Cut Tape (CT); Diode Type: Schottky; Voltage - DC Reverse (Vr) (Max): 40V; Current - Average Rectified (Io): 1A; Reverse Recovery Time (trr): -; Capacitance @ Vr, F: -; Mounting Type: Surface Mount; Package / Case: SOD-123F; Supplier Device Package: SOD-123L; Operating Temperature - Junction: -55°C ~ 125°C; ComponentLink1URL: http://www.onsemi.com/pub_link/Collateral/MBR140SFT1-D.PDF; ComponentLink1Description: http://www.onsemi.com/pub_link/Collateral/MBR140SFT1-D.PDF; Supplier Part Number 1: MBR140SFT1GOSCT-ND; .Checked SCH: used
D28 = 1N4148WS: DIODE GEN PURP 75V 150MA SOD323F; Manufacturer: ON Semiconductor; Diode Type: Standard; Speed: Small Signal =< 200mA (Io), Any Speed; Capacitance @ Vr, F: 4pF @ 0V, 1MHz; .Creator: MB; Supplier 1: Digi-Key; Manufacturer Part Number: 1N4148WS; RoHS: RoHS Compliant; Category: Discrete Semiconductor Products; Packaging: Cut Tape (CT); Part Status: Active; Current - Average Rectified (Io): 150mA; Mounting Type: Surface Mount; Package / Case: SC-90, SOD-323F; Supplier Device Package: SOD-323F; Operating Temperature - Junction: 150°C (Max); Base Part Number: 1N4148; ComponentLink1URL: https://www.fairchildsemi.com/datasheets/1N/1N4148WS.pdf; ComponentLink1Description: https://www.fairchildsemi.com/datasheets/1N/1N4148WS.pdf; .Checked PCB: *; .Checked SCH: *; Supplier Part Number 1: 1N4148WSFSCT-ND
D29 D32 = LG L29K-G2J1-24-Z: LED SMARTLED GREEN 570NM 0603; Manufacturer: OSRAM Opto Semiconductors Inc; .Checked PCB: used; Current - Test: 2mA; Voltage - Forward (Vf) Typ: 1.7V; Luminous Flux @ Current - Test: 12 mlm; Millicandela Rating: 3.92mcd; Wavelength - Peak: 572nm; Lens Type: Diffused; Lens Style/Size: Rectangle with Flat Top, 1.3mm x 0.8mm; Viewing Angle: 160°; Regulator Topology: Positive Fixed; Voltage - Output: 2.5V; Voltage - Input: 2.6 V ~ 6 V; Voltage - Dropout (Typical): 0.16V @ 500mA; Number of Regulators: 1; Current - Output: 500mA; Current - Limit (Min): 600mA; .Checked SCH: used; Category: Optoelectronics; Supplier Part Number: 475-2709-1-ND; Family: LEDs - <75mA, Discre; Manufacturer Part Number: LG L29K-G2J1-24-Z; Price 1k [$]: 0.08744; Value: Green; Color: Green; Package / Case: 0603 (1608 Metric); Supplier: Digikey; Supplier 1: Digi-Key; Supplier Part Number 1: 475-2709-1-ND; RoHS: RoHS Compliant; Stock 1: 30318; Pricing 1: 1=0.16, 10=0.137, 100=0.1093, 250=0.09564, 500=0.08744 (USD); Wavelength - Dominant: 570nm; Size / Dimension: 1.70mm L x 0.80mm W; Height: 0.65mm; Mounting Type: Surface Mount; Packaging: Cut Tape (CT); ComponentLink1URL: http://catalog.osram-os.com/catalogue/catalogue.do;jsessionid=32CB61882C089EDD4B6D0A54E7E1F117?act=downloadFile&favOid=020000020000138e000100b6; ComponentLink1Description: http://catalog.osram-os.com/catalogue/catalogue.do;jsessionid=32CB61882C089EDD4B6D0A54E7E1F117?act=downloadFile&favOid=020000020000138e000100b6; Operating Temperature: -40°C ~ 125°C; Supplier Device Package: 6-TMLF® (1.6x1.6); ComponentLink2URL: http://www.micrel.com/_PDF/mic5353.pdf; ComponentLink2Description: http://www.micrel.com/_PDF/mic5353.pdf
D30 = BZA956A,115: TVS ZENER QUAD 5.6V SOT665; Manufacturer: NXP Semiconductors; Voltage - Reverse Standoff (Typ): 3V; Voltage - Breakdown: 5.32V; Power (Watts): 16W; Polarization: 4 Channel Array - Unidirectional; .Creator: MM; .Checked PCB: used; Supplier 1: Digi-Key; Manufacturer Part Number: BZA956A,115; RoHS: RoHS Compliant; Category: Circuit Protection; Packaging: Cut Tape (CT); Mounting Type: Surface Mount; Package / Case: SOT-665; Supplier Device Package: SOT-665; ComponentLink1URL: http://www.nxp.com/documents/data_sheet/BZA900A_SERIES.pdf; ComponentLink1Description: http://www.nxp.com/documents/data_sheet/BZA900A_SERIES.pdf; Supplier Part Number 1: 1727-5529-1-ND; .Checked SCH: used
D31 = LS L29K-H1J2-1-Z: LED SMARTLED RED 630NM 0603 SMD; Manufacturer: OSRAM Opto Semiconductors Inc; Millicandela Rating: 4.95mcd; Voltage - Forward (Vf) Typ: 1.8V; Current - Test: 2mA; Wavelength - Peak: 643nm; Viewing Angle: 160°; Lens Type: Diffused; Lens Style/Size: Rectangle with Flat Top, 1.3mm x 0.8mm; Luminous Flux @ Current - Test: 20 mlm; .Checked PCB: used; Supplier 1: Digi-Key; Supplier Part Number 1: 475-1195-1-ND; Manufacturer Part Number: LS L29K-H1J2-1-Z; RoHS: RoHS Compliant; Category: Optoelectronics; Stock 1: 71670; Pricing 1: 1=0.16, 10=0.137, 100=0.1093, 250=0.09564, 500=0.08744 (USD); Color: Red; Wavelength - Dominant: 630nm; Package / Case: 0603 (1608 Metric); Size / Dimension: 1.70mm L x 0.80mm W; Height: 0.65mm; Mounting Type: Surface Mount; Packaging: Cut Tape (CT); ComponentLink1URL: http://catalog.osram-os.com/catalogue/catalogue.do;jsessionid=DB7CFDBAC5AF1E216E45F622E867085A?act=downloadFile&favOid=020000010003f9de000100b6; ComponentLink1Description: http://catalog.osram-os.com/catalogue/catalogue.do;jsessionid=DB7CFDBAC5AF1E216E45F622E867085A?act=downloadFile&favOid=020000010003f9de000100b6; .Checked SCH: used
FB43 = MPZ1608S601A: FERRITE CHIP BEAD 600 OHM SMD 1A; Manufacturer: TDK Corporation; Impedance @ Frequency: 600 Ohm @ 100MHz; DC Resistance (DCR): 150 mOhm Max; Filter Type: Differential Mode - Single; Number of Lines: 1; .Checked PCB: used; Supplier 1: Digi-Key; Supplier Part Number 1: 445-2205-1-ND; Manufacturer Part Number: MPZ1608S601A; RoHS: RoHS Compliant; Category: Filters; Stock 1: 328345; Pricing 1: 1=0.36, 10=0.24, 100=0.096, 250=0.069, 500=0.0492, 1000=0.036 (USD); Current Rating: 1A; Package / Case: 0603 (1608 Metric); Mounting Type: Surface Mount; Packaging: Cut Tape (CT); Height (Max): 0.037" (0.95mm); Size / Dimension: 0.063" L x 0.031" W (1.60mm x 0.80mm); ComponentLink1URL: http://www.tdk.co.jp/tefe02/e9413_mpz.pdf; ComponentLink1Description: http://www.tdk.co.jp/tefe02/e9413_mpz.pdf; .Checked SCH: used
FB44-FB47 = BLM18SG221TN1D: FERRITE CHIP 220 OHM 2500MA 0603; Manufacturer: Murata Electronics North America; Impedance @ Frequency: 220 Ohm @ 100MHz; DC Resistance (DCR): 40 mOhm Max; Filter Type: Differential Mode - Single; Number of Lines: 1; .Checked PCB: used; Supplier 1: Digi-Key; Supplier Part Number 1: 490-5225-1-ND; Manufacturer Part Number: BLM18SG221TN1D; RoHS: RoHS Compliant; Category: Filters; Stock 1: 54640; Pricing 1: 1=0.38, 10=0.282, 50=0.1646, 100=0.1316, 250=0.094, 500=0.06392, 1000=0.0517, 5000=0.04042 (USD); Current Rating: 2.5A; Package / Case: 0603 (1608 Metric); Mounting Type: Surface Mount; Packaging: Cut Tape (CT); Height (Max): 0.037" (0.95mm); Size / Dimension: 0.063" L x 0.031" W (1.60mm x 0.80mm); ComponentLink1URL: http://search.murata.co.jp/Ceramy/image/img/PDF/ENG/L0110S0100BLM18S.pdf; ComponentLink1Description: http://search.murata.co.jp/Ceramy/image/img/PDF/ENG/L0110S0100BLM18S.pdf; .Checked SCH: used
L10 = IHLP2525CZER100M11: FIXED IND 10UH 4A 71.2 MOHM SMD; Manufacturer: Vishay Dale; Type: Molded; Material - Core: Powdered Iron; Tolerance: ±20%; Shielding: Shielded; DC Resistance (DCR): 71.2 mOhm Max; .Creator: MB; Supplier 1: Digi-Key; Manufacturer Part Number: IHLP2525CZER100M11; RoHS: RoHS Compliant; Category: Inductors, Coils, Chokes; Stock 1: 14061; Pricing 1: 1=1.72, 10=1.587, 100=1.1109, 500=0.8993, 1000=0.81995 (USD); Packaging: Cut Tape (CT); Part Status: Active; Q @ Freq: -; Ratings: -; Operating Temperature: -55°C ~ 125°C; Mounting Type: Surface Mount; Package / Case: Nonstandard; Supplier Device Package: -; Size / Dimension: 0.270" L x 0.255" W (6.86mm x 6.47mm); Height - Seated (Max): 0.118" (3.00mm); ComponentLink1URL: http://www.vishay.com/docs/34190/ihlp25cz.pdf; ComponentLink1Description: http://www.vishay.com/docs/34190/ihlp25cz.pdf; Supplier Part Number 1: 541-2577-1-ND; .Checked PCB: *; .Checked SCH: *
LCD1 = 0541324062: CONN FFC BOTTOM 40POS 0.50MM R/A; Manufacturer: Molex; Actuator Material: Glass,Polyphenylene; Contact Resistance: 20mR; Current Rating: 500mA; Voltage Rating: 50V; Number of Positions: 40; Wire/Cable Type: Straight; Pitch: 0.5mm; .Creator: MB; Supplier 1: Digi-Key; Manufacturer Part Number: 0541324062; Stock 1: 22791; Pricing 1: 1=2.05, 10=1.861, 25=1.7472, 50=1.6712, 100=1.5953, 250=1.44336, 500=1.3294 (USD); Mount: Surface Mount; Contact Material: Bronze; Contact Plating: Nickel,Gold; Housing Colour: Black; Housing Material: Nylon; Min Operating Temperature: -20°C; Max Operating Temperature: 85°C; Number of Rows: 1; Packaging: Tape and Reel; Package Quantity: 1; Termination: Solder; Number of Contacts: 40; Orientation: Right Angle; Length: 25.5mm; Depth: 5.6mm; Flammability Rating: UL94 V-0; ComponentLink1URL: https://datasheet.ciiva.com/671/541323062-sd-671324.pdf; ComponentLink1Description: https://datasheet.ciiva.com/671/541323062-sd-671324.pdf; ComponentLink2URL: https://datasheet.ciiva.com/671/541324062-sd-671416.pdf; ComponentLink2Description: https://datasheet.ciiva.com/671/541324062-sd-671416.pdf; ComponentLink3URL: https://datasheet.ciiva.com/671/541324062-sd-671417.pdf; ComponentLink3Description: https://datasheet.ciiva.com/671/541324062-sd-671417.pdf; Supplier Part Number 1: WM3436DKR-ND; .Checeked SCH: *; .Checked PCB: *
LCD2 = NHD-4.3-480272MB-ASXN-CTP: LCD TFT 4.3" Mountable; Manufacturer: Newhaven Display; .Creator: MB; Supplier 1: Digi-Key; Manufacturer Part Number: NHD-4.3-480272MB-ASXN-CTP; Stock 1: 0; Pricing 1: 1=63.75, 5=59.926, 10=56.1, 50=54.9 (USD); .Checked SCH: *; .Checked PCB: *; Supplier Part Number 1: NHD-4.3-480272MB-ASXN-CTP-ND; ComponentLink1Description: Mechanical Drawing; ComponentLink1URL: http://www.newhavendisplay.com/specs/Drawing-NHD-4.3-480272MB-xxxx-CTP.pdf; ComponentLink2Description: Data Sheet; ComponentLink2URL: http://www.newhavendisplay.com/specs/NHD-4.3-480272EF-ATXL-CTP.pdf
Q13-Q15 = 2N7002BKW,115: MOSFET N-CH 60V 310MA SOT323; Manufacturer: NXP Semiconductors; FET Type: MOSFET N-Channel, Metal Oxide; FET Feature: Logic Level Gate; Rds On (Max) @ Id, Vgs: 1.6 Ohm @ 500mA, 10V; Vgs(th) (Max) @ Id: 2.1V @ 250µA; Gate Charge (Qg) @ Vgs: 0.6nC @ 4.5V; Input Capacitance (Ciss) @ Vds: 50pF @ 10V; Power - Max: 275mW; .Checked PCB: used; Supplier 1: Digi-Key; Supplier Part Number 1: 1727-4788-1-ND; Manufacturer Part Number: 2N7002BKW,115; RoHS: RoHS Compliant; Category: Discrete Semiconductor Products; Drain to Source Voltage (Vdss): 60V; Current - Continuous Drain (Id) @ 25° C: 310mA; Mounting Type: Surface Mount; Package / Case: SC-70, SOT-323; Supplier Device Package: SC-70; Packaging: Cut Tape (CT); ComponentLink1URL: http://www.nxp.com/documents/data_sheet/2N7002BKW.pdf; ComponentLink1Description: http://www.nxp.com/documents/data_sheet/2N7002BKW.pdf; .Checked SCH: used
R327 = RC0402FR-0747KL: RES 47.0K OHM 1/16W 1% 0402 SMD; Manufacturer: Yageo; Power (Watts): 0.063W, 1/16W; .Checked PCB: used; Temperature Coefficient: ±100ppm/°C; Category: Resistors; Supplier Part Number: 311-47.0KLRCT-ND; Manufacturer Part Number: RC0402FR-0747KL; Package / Case: 0402 (1005 Metric); Price 1k [$]: 0.01421; Resistance (Ohms): 47K; Tolerance: ±1%; Value: 47k; .Checked SCH: used; Supplier: Digikey; Supplier 1: Digi-Key; Supplier Part Number 1: 311-47.0KLRCT-ND; RoHS: RoHS Compliant; Stock 1: 1227580; Pricing 1: 10=0.014, 50=0.0104, 100=0.0079, 250=0.00584, 500=0.00432, 1000=0.00288 (USD); Composition: Thick Film; Features: -; Size / Dimension: 0.039" L x 0.020" W (1.00mm x 0.50mm); Height: 0.016" (0.40mm); Number of Terminations: 2; Packaging: Cut Tape (CT); ComponentLink1URL: http://www.yageo.com/documents/recent/PYu-RC0402_51_RoHS_L_6.pdf; ComponentLink1Description: http://www.yageo.com/documents/recent/PYu-RC0402_51_RoHS_L_6.pdf; Supplier 2: Digi-Key; Supplier Part Number 2: 1276-3467-1-ND
R328 = RC0402FR-073R3L: RES SMD 3.3 OHM 1% 1/16W 0402; Manufacturer: Yageo; Power (Watts): 0.063W, 1/16W; Temperature Coefficient: ±200ppm/°C; Supplier 1: Digi-Key; Manufacturer Part Number: RC0402FR-073R3L; RoHS: RoHS Compliant; Category: Resistors; Stock 1: 318027; Pricing 1: 1=0.1, 10=0.02, 100=0.0083, 1000=0.00372, 2500=0.00323, 5000=0.00267 (USD); Packaging: Cut Tape (CT); Part Status: Active; Tolerance: ±1%; Composition: Thick Film; Features: Moisture Resistant; Operating Temperature: -55°C ~ 155°C; Package / Case: 0402 (1005 Metric); Supplier Device Package: 0402; Size / Dimension: 0.039" L x 0.020" W (1.00mm x 0.50mm); Height - Seated (Max): 0.016" (0.40mm); Failure Rate: -; ComponentLink1URL: http://www.yageo.com/documents/recent/PYu-RC_Group_51_RoHS_L_9.pdf; ComponentLink1Description: http://www.yageo.com/documents/recent/PYu-RC_Group_51_RoHS_L_9.pdf; Supplier Part Number 1: 311-3.30LRCT-ND
R329 R330 R342 R345 R348 R350 R351 R589 = RC0402JR-070RL: RES 0.0 OHM 1/16W 0402 SMD; Manufacturer: Yageo; Resistance (Ohms): 0.0; Power (Watts): 0.063W, 1/16W; Tolerance: Jumper; .Checked PCB: used; Category: Resistors; Supplier Part Number: 311-0.0JRCT-ND; Manufacturer Part Number: RC0402JR-070RL; Package / Case: 0402 (1005 Metric); Price 1k [$]: 0.01389; Value: 0R; .Checked SCH: used; Supplier: Digikey; Supplier 1: Digi-Key; Supplier Part Number 1: 311-0.0JRCT-ND; RoHS: RoHS Compliant; Stock 1: 1106330; Pricing 1: 10=0.012, 50=0.009, 100=0.0069, 250=0.00512, 500=0.0038, 1000=0.00253 (USD); Composition: Thick Film; Features: -; Temperature Coefficient: -; Size / Dimension: 0.039" L x 0.020" W (1.00mm x 0.50mm); Height: 0.016" (0.40mm); Number of Terminations: 2; Packaging: Cut Tape (CT); ComponentLink1URL: http://www.yageo.com/documents/recent/PYu-RC0402_51_RoHS_L_6.pdf; ComponentLink1Description: http://www.yageo.com/documents/recent/PYu-RC0402_51_RoHS_L_6.pdf
R331-R341 R343 R344 R346 R347 R349 R352 R354-R364 R369-R372 = RC0201FR-0733RL: RES 33 OHM 1% 1/20W 0201; Manufacturer: Yageo; Power Rating: 50mW; Voltage Rating: 25V; Temperature Coefficient: 200ppm/°C; .Creator: MB; Supplier 1: Mouser; Manufacturer Part Number: RC0201FR-0733RL; Stock 1: 17957; Pricing 1: 1=0.1, 10=0.057, 50=0.057, 100=0.024, 1000=0.011, 10000=0.007 (USD); Case/Package: 0201; Case Code (Metric): 0603; Case Code (Imperial): 0201; Min Operating Temperature: -55°C; Max Operating Temperature: 125°C; Resistance: 33; Tolerance: 1%; Package Quantity: 1; Packaging: Tape and Reel; Composition: Thick Film; Number of Terminations: 2; Termination: SMD/SMT; Max Power Dissipation: 50mW; Length: 0.024inch; Height: 0.01inch; Width: 0.012inch; REACH SVHC: Unknown; Lead Free: Lead Free; ComponentLink1URL: https://datasheet.ciiva.com/22698/1563626-22698520.pdf; ComponentLink1Description: https://datasheet.ciiva.com/22698/1563626-22698520.pdf; ComponentLink2URL: https://datasheet.ciiva.com/2560/pyu-r-int-thick-7-2560877.pdf; ComponentLink2Description: https://datasheet.ciiva.com/2560/pyu-r-int-thick-7-2560877.pdf; ComponentLink3URL: https://datasheet.ciiva.com/2560/pyu-r-int-thick-7-2560878.pdf; ComponentLink3Description: https://datasheet.ciiva.com/2560/pyu-r-int-thick-7-2560878.pdf; ComponentLink4URL: https://datasheet.ciiva.com/2560/pyu-r-int-thick-7-2560879.pdf; ComponentLink4Description: https://datasheet.ciiva.com/2560/pyu-r-int-thick-7-2560879.pdf; ComponentLink5URL: https://datasheet.ciiva.com/7672/1563626-7672223.pdf; ComponentLink5Description: https://datasheet.ciiva.com/7672/1563626-7672223.pdf; Supplier Part Number 1: 603-RC0201FR-0733RL; .Checked SCH: *; .Checked PCB: *
R353 R366 R367 R374 R375 = RC0201FR-071KL: RES 1K OHM 1/20W 1% 0201 SMD; Manufacturer: Yageo; Power (Watts): 0.05W, 1/20W; Temperature Coefficient: ±200ppm/°C; .Creator: MM; .Checked PCB: used; Supplier 1: Digi-Key; Manufacturer Part Number: RC0201FR-071KL; RoHS: RoHS Compliant; Category: Resistors; Stock 1: 0; Pricing 1: 1=0.1, 10=0.074, 25=0.054, 100=0.0303, 250=0.02312, 500=0.0185, 1000=0.01361, 2500=0.01182, 5000=0.00976 (USD); Packaging: Cut Tape (CT); Resistance (Ohms): 1k; Tolerance: ±1%; Composition: Thick Film; Features: Moisture Resistant; Package / Case: 0201 (0603 Metric); Supplier Device Package: 0201; Size / Dimension: 0.024" L x 0.012" W (0.60mm x 0.30mm); Height: 0.010" (0.26mm); Number of Terminations: 2; ComponentLink1URL: http://www.yageo.com/documents/recent/PYu-RC0201_51_RoHS_L_8.pdf; ComponentLink1Description: http://www.yageo.com/documents/recent/PYu-RC0201_51_RoHS_L_8.pdf; Supplier Part Number 1: 311-1KMCT-ND; .Checked SCH: used
R365 = RC0603F473CS: RES 47K OHM 1% 1/20W 0201; Manufacturer: Samsung; Max Power Dissipation: 50mW; Temperature Coefficient: 250ppm/°C; Voltage Rating (DC): 25V; .Creator: MB; Supplier 1: Digi-Key; Manufacturer Part Number: RC0603F473CS; Stock 1: 68760; Pricing 1: 1=0.1, 10=0.021, 100=0.0086, 1000=0.00385, 2500=0.00334, 5000=0.00276 (USD); Case/Package: 0201; Case Code (Metric): 0603; Case Code (Imperial): 0201; Contact Plating: Tin; Min Operating Temperature: -55°C; Max Operating Temperature: 125°C; Packaging: Tape and Reel; Resistance: 47k; Tolerance: 1%; Composition: Thick Film; Number of Terminations: 2; Length: 0.024inch; Height: 0.01inch; Width: 0.012inch; Radiation Hardening: No; Lead Free: Lead Free; ComponentLink1URL: https://datasheet.ciiva.com/26129/chip-resistor-150112-1-26129736.pdf; ComponentLink1Description: https://datasheet.ciiva.com/26129/chip-resistor-150112-1-26129736.pdf; ComponentLink2URL: https://datasheet.ciiva.com/26129/chip-resistor-150112-1-26129722.pdf; ComponentLink2Description: https://datasheet.ciiva.com/26129/chip-resistor-150112-1-26129722.pdf; ComponentLink3URL: https://datasheet.ciiva.com/26129/chip-resistor-150112-1-26129757.pdf; ComponentLink3Description: https://datasheet.ciiva.com/26129/chip-resistor-150112-1-26129757.pdf; .Checked SCH: *; Supplier Part Number 1: 1276-3701-6-ND; .Checked PCB: *
R368 = RC0201FR-0710KL: RES 10K OHM 1/20W 1% 0201 SMD; Manufacturer: Yageo; Power (Watts): 0.05W, 1/20W; Temperature Coefficient: ±200ppm/°C; .Creator: MM; .Checked PCB: used; Supplier 1: Digi-Key; Manufacturer Part Number: RC0201FR-0710KL; RoHS: RoHS Compliant; Category: Resistors; Stock 1: 529049; Pricing 1: 1=0.1, 10=0.074, 25=0.054, 100=0.0303, 250=0.02312, 500=0.0185, 1000=0.01361, 2500=0.01182, 5000=0.00976 (USD); Packaging: Cut Tape (CT); Resistance (Ohms): 10k; Tolerance: ±1%; Composition: Thick Film; Features: Moisture Resistant; Package / Case: 0201 (0603 Metric); Supplier Device Package: 0201; Size / Dimension: 0.024" L x 0.012" W (0.60mm x 0.30mm); Height: 0.010" (0.26mm); Number of Terminations: 2; ComponentLink1URL: http://www.yageo.com/documents/recent/PYu-RC0201_51_RoHS_L_8.pdf; ComponentLink1Description: http://www.yageo.com/documents/recent/PYu-RC0201_51_RoHS_L_8.pdf; Supplier Part Number 1: 311-10.0KMCT-ND; .Checked SCH: used; Supplier 2: Digi-Key; Supplier Part Number 2: 541-10.0KABCT-ND
R373 = RC0201FR-07100KL: RES 100K OHM 1/20W 1% 0201 SMD; Manufacturer: Yageo; Power (Watts): 0.05W, 1/20W; Temperature Coefficient: ±200ppm/°C; .Creator: MM; .Checked PCB: used; Supplier 1: Digi-Key; Manufacturer Part Number: RC0201FR-07100KL; RoHS: RoHS Compliant; Category: Resistors; Stock 1: 0; Pricing 1: 1=0.1, 10=0.074, 25=0.054, 100=0.0303, 250=0.02312, 500=0.0185, 1000=0.01361, 2500=0.01182, 5000=0.00976 (USD); Packaging: Cut Tape (CT); Resistance (Ohms): 100k; Tolerance: ±1%; Composition: Thick Film; Features: Moisture Resistant; Package / Case: 0201 (0603 Metric); Supplier Device Package: 0201; Size / Dimension: 0.024" L x 0.012" W (0.60mm x 0.30mm); Height: 0.010" (0.26mm); Number of Terminations: 2; ComponentLink1URL: http://www.yageo.com/documents/recent/PYu-RC0201_51_RoHS_L_8.pdf; ComponentLink1Description: http://www.yageo.com/documents/recent/PYu-RC0201_51_RoHS_L_8.pdf; Supplier Part Number 1: 311-100KMCT-ND; .Checked SCH: used; Supplier 2: Digi-Key; Supplier Part Number 2: 1276-3714-1-ND
R575 = RC0805JR-070RL_small: RES 0.0 OHM 1/8W 0805 SMD; Manufacturer: Yageo; Resistance (Ohms): 0.0; Power (Watts): 0.125W, 1/8W; Tolerance: Jumper; .Checked PCB: used; .Creator: MM; Category: Resistors; Supplier Part Number: 311-0.0ARCT-ND; Manufacturer Part Number: RC0805JR-070RL; Package / Case: 0805 (2012 Metric); Price 1k [$]: 0.01479; Value: 0R; .Checked SCH: used; Supplier: Digikey; Supplier 1: Digi-Key; Supplier Part Number 1: 311-0.0ARCT-ND; RoHS: RoHS Compliant; Stock 1: 933202; Pricing 1: 10=0.017, 50=0.0126, 100=0.0096, 250=0.00716, 500=0.00528, 1000=0.00352 (USD); Composition: Thick Film; Features: -; Temperature Coefficient: -; Size / Dimension: 0.079" L x 0.049" W (2.00mm x 1.25mm); Height: 0.024" (0.60mm); Number of Terminations: 2; Packaging: Cut Tape (CT); ComponentLink1URL: http://www.yageo.com/documents/recent/PYu-RC0805_51_RoHS_L_4.pdf; ComponentLink1Description: http://www.yageo.com/documents/recent/PYu-RC0805_51_RoHS_L_4.pdf
SW3 = SSSS811101: Slide Switches SPDT HORZ GRND 1.5mm; Manufacturer: Alps Electric; Mechanical Life: 10000Cycles; Throw Configuration: SP,SPDT; Max Voltage Rating (DC): 5V; Contact Current Rating: 300mA; Voltage Rating (AC): 4V; Contact Resistance: 70mR; Supplier 1: Mouser; Manufacturer Part Number: SSSS811101; Stock 1: 37406; Pricing 1: 1=0.97, 10=0.97, 50=0.819, 100=0.726, 1000=0.533, 10000=0.502 (USD); Mount: Surface Mount; Case/Package: SMD/SMT; Min Operating Temperature: -10°C; Max Operating Temperature: 85°C; Termination: Gull Wing; Packaging: Tape and Reel; Electrical Life: 10000Cycles; Orientation: Right Angle; Length: 7.7mm; Depth: 5mm; Radiation Hardening: No; Lead Free: Lead Free; ComponentLink1URL: https://datasheet.ciiva.com/18147/getdatasheetpartid-652127-18147399.pdf; ComponentLink1Description: https://datasheet.ciiva.com/18147/getdatasheetpartid-652127-18147399.pdf; ComponentLink2URL: https://datasheet.ciiva.com/16174/623ssss8-16174702.pdf; ComponentLink2Description: https://datasheet.ciiva.com/16174/623ssss8-16174702.pdf; .Checked PCH: *; .Checked SCH: *; .Creator: *; Supplier Part Number 1: 688-SSSS811101
TP56 = TP_25MILC: Test Point 25mil; .Checked PCB: used
U41 = TPS61165DRVR: IC LED DRVR RGLTR DIM 1.2A 6SON; Manufacturer: Texas Instruments; Topology: Step-Up (Boost); Internal Switch(s): Yes; Number of Outputs: 1; Voltage - Supply (Min): 3V; Voltage - Supply (Max): 18V; Voltage - Output: 3 V ~ 38 V; Current - Output / Channel: 1.2A (Switch); Frequency: 1.2MHz; Dimming: PWM; .Creator: MB; Supplier 1: Digi-Key; Manufacturer Part Number: TPS61165DRVR; RoHS: RoHS Compliant; Category: Integrated Circuits (ICs); Stock 1: 17685; Pricing 1: 1=1.87, 10=1.681, 100=1.3514, 500=1.11034, 1000=0.92 (USD); Packaging: Cut Tape (CT); Part Status: Active; Type: DC DC Regulator; Applications: Automotive, Backlight; Operating Temperature: -40°C ~ 85°C (TA); Mounting Type: Surface Mount; Package / Case: 6-WDFN Exposed Pad; Supplier Device Package: 6-SON (2x2); Base Part Number: TPS61165; ComponentLink1URL: http://www.ti.com/lit/ds/symlink/tps61165.pdf; ComponentLink1Description: http://www.ti.com/lit/ds/symlink/tps61165.pdf; Supplier Part Number 1: 296-22944-1-ND; .Checked PCB: *; .Checked SCH: *
U42 = TFP401AIPZPRQ1: Digital Receiver 3RX 100-Pin HTQFP EP T/R; Manufacturer: Texas Instruments; Nominal Supply Current: 370mA; Max Dual Supply Voltage: 3.6V; Min Dual Supply Voltage: 3V; Dual Supply Voltage: 3.3V; .Creator: MB; Supplier 1: Mouser; Manufacturer Part Number: TFP401AIPZPRQ1; Stock 1: 0; Pricing 1: 1=9.68, 10=8.75, 50=8.1, 100=7.24, 1000=5.49, 10000=5.49 (USD); Mount: Surface Mount; Number of Pins: 100; Min Operating Temperature: -40°C; Max Operating Temperature: 85°C; Packaging: Tape and Reel; Package Quantity: 900; Radiation Hardening: No; Lead Free: Lead Free; ComponentLink1URL: https://datasheet.ciiva.com/6634/slds190-6634593.pdf; ComponentLink1Description: https://datasheet.ciiva.com/6634/slds190-6634593.pdf; ComponentLink2URL: https://datasheet.ciiva.com/26913/getdatasheetpartid-720456-26913091.pdf; ComponentLink2Description: https://datasheet.ciiva.com/26913/getdatasheetpartid-720456-26913091.pdf; ComponentLink3URL: https://datasheet.ciiva.com/24101/slds190-260996-24101855.pdf; ComponentLink3Description: https://datasheet.ciiva.com/24101/slds190-260996-24101855.pdf; Supplier Part Number 1: 595-TFP401AIPZPRQ1; .Checked PCB: *; .Checked SCH: *
U43 = PIC18F4550-I/ML: IC MCU 8BIT 32KB FLASH 44QFN; Manufacturer: Microchip; Interface: I2C,SPI,USB,UART,USART; Data Bus Width: 8b; Core Architecture: PIC; Number of Timers/Counters: 4; Min Supply Voltage: 4.2V; Max Supply Voltage: 5.5V; Number of PWM Channels: 1; RAM Size: 2KB; Number of I/Os: 35; Max Power Dissipation: 1W; Frequency: 48MHz; Number of ADC Channels: 13; Number of Bits: 8; Oscillator Type: Internal; Watchdog Timer: Yes; Peripherals: Brown-out Detect/Reset,POR,PWM,WDT,HLVD,I2C; Number of Outputs: 34; Access Time: 48us; .Creator: MB; Supplier 1: Digi-Key; Manufacturer Part Number: PIC18F4550-I/ML; Stock 1: 752; Pricing 1: 1=4.73, 25=4.6248, 100=4.5114 (USD); Mount: Surface Mount; Case/Package: QFN; Number of Pins: 44; Min Operating Temperature: -40°C; Max Operating Temperature: 85°C; Package Quantity: 45; Packaging: Rail/Tube; Density: 32KB; Number of UART Channels: 1; Number of Programmable I/O: 35; Max Frequency: 48MHz; Number of SPI Channels: 1; Number of I2C Channels: 1; Memory Type: FLASH; Memory Size: 32KB; Number of Inputs: 35; Number of USB Channels: 1; Length: 8mm; Height: 0.95mm; Width: 8mm; Radiation Hardening: No; Lead Free: Lead Free; REACH SVHC: No SVHC; ComponentLink1URL: https://datasheet.ciiva.com/9244/39632d-9244677.pdf; ComponentLink1Description: https://datasheet.ciiva.com/9244/39632d-9244677.pdf; ComponentLink2URL: https://datasheet.ciiva.com/1494/39632e-1494715.pdf; ComponentLink2Description: https://datasheet.ciiva.com/1494/39632e-1494715.pdf; ComponentLink3URL: https://datasheet.ciiva.com/7774/39632e-7774431.pdf; ComponentLink3Description: https://datasheet.ciiva.com/7774/39632e-7774431.pdf; Supplier Part Number 1: PIC18F4550-I/ML-ND; .Checked SCH: *; .Checked PCB: *
Y6 = 7M-20.000MAAJ-T: CRYSTAL 20MHZ 18PF SMD; Manufacturer: TXC CORPORATION; Frequency Stability: ±30ppm; Operating Mode: Fundamental; .Creator: MB; Supplier 1: Digi-Key; Manufacturer Part Number: 7M-20.000MAAJ-T; RoHS: RoHS Compliant; Category: Crystals, Oscillators, Resonators; Stock 1: 26185; Pricing 1: 1=1, 10=0.886, 50=0.8278, 100=0.7315, 500=0.693, 1000=0.5775 (USD); Packaging: Cut Tape (CT); Part Status: Active; Type: MHz Crystal; Frequency Tolerance: ±30ppm; Load Capacitance: 18pF; Operating Temperature: -20°C ~ 70°C; Ratings: -; Mounting Type: Surface Mount; Package / Case: 4-SMD, No Lead; Size / Dimension: 0.126" L x 0.098" W (3.20mm x 2.50mm); Height - Seated (Max): 0.032" (0.80mm); ComponentLink1URL: http://www.txccorp.com/download/products/quartz_crystals/2015TXC_7M_17.pdf; ComponentLink1Description: http://www.txccorp.com/download/products/quartz_crystals/2015TXC_7M_17.pdf; .Checked PCB: *; .Checked SCH: *; Supplier Part Number 1: 887-1129-1-ND